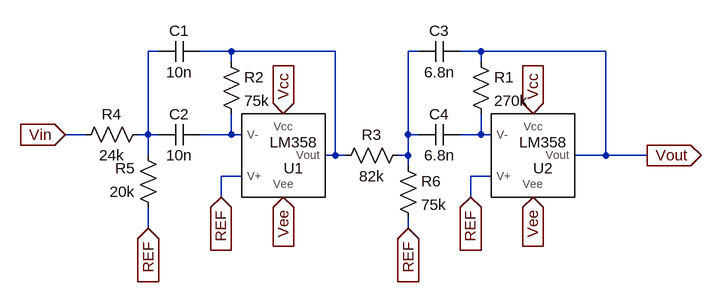
[diagram p0: schematic filter_stage.asc]
filter_stage.asc, the LTspice schematic file:
Version 4
SHEET 1 880 680
WIRE -16 16 -32 16
WIRE 96 16 48 16
WIRE 256 16 96 16
WIRE 384 16 368 16
WIRE 480 16 448 16
WIRE 672 16 480 16
WIRE 96 32 96 16
WIRE 480 32 480 16
WIRE -128 144 -160 144
WIRE -32 144 -32 16
WIRE -32 144 -48 144
WIRE -16 144 -32 144
WIRE 96 144 96 112
WIRE 96 144 48 144
WIRE 112 144 96 144
WIRE 368 144 368 16
WIRE 384 144 368 144
WIRE 480 144 480 112
WIRE 480 144 448 144
WIRE 496 144 480 144
WIRE -32 176 -32 144
WIRE 256 176 256 16
WIRE 256 176 240 176
WIRE 272 176 256 176
WIRE 368 176 368 144
WIRE 368 176 352 176
WIRE 672 176 672 16
WIRE 672 176 624 176
WIRE 736 176 672 176
WIRE 368 192 368 176
WIRE 112 208 80 208
WIRE 496 208 464 208
WIRE 80 240 80 208
WIRE 464 240 464 208
WIRE -32 288 -32 256
WIRE 368 288 368 272
FLAG -32 288 REF
IOPIN -32 288 In
FLAG -160 144 Vin
IOPIN -160 144 In
FLAG 736 176 Vout
IOPIN 736 176 Out
FLAG 560 112 Vcc
IOPIN 560 112 In
FLAG 176 112 Vcc
IOPIN 176 112 In
FLAG 560 240 Vee
IOPIN 560 240 In
FLAG 80 240 REF
IOPIN 80 240 In
FLAG 368 288 REF
IOPIN 368 288 In
FLAG 464 240 REF
IOPIN 464 240 In
FLAG 176 240 Vee
IOPIN 176 240 In
SYMBOL LM358 192 176 R0
SYMATTR InstName U1
SYMBOL LM358 576 176 R0
SYMATTR InstName U2
SYMBOL cap 48 128 R90
WINDOW 0 0 32 VBottom 2
WINDOW 3 32 32 VTop 2
SYMATTR InstName C2
SYMATTR Value 10n
SYMBOL cap 448 0 R90
WINDOW 0 0 32 VBottom 2
WINDOW 3 32 32 VTop 2
SYMATTR InstName C3
SYMATTR Value 6.8n
SYMBOL cap 448 128 R90
WINDOW 0 0 32 VBottom 2
WINDOW 3 32 32 VTop 2
SYMATTR InstName C4
SYMATTR Value 6.8n
SYMBOL res 464 16 R0
SYMATTR InstName R1
SYMATTR Value 270k
SYMBOL cap -16 0 M90
WINDOW 0 0 32 VBottom 2
WINDOW 3 32 32 VTop 2
SYMATTR InstName C1
SYMATTR Value 10n
SYMBOL res 80 16 R0
SYMATTR InstName R2
SYMATTR Value 75k
SYMBOL res 368 160 R90
WINDOW 0 0 56 VBottom 2
WINDOW 3 32 56 VTop 2
SYMATTR InstName R3
SYMATTR Value 82k
SYMBOL res -32 128 R90
WINDOW 0 0 56 VBottom 2
WINDOW 3 32 56 VTop 2
SYMATTR InstName R4
SYMATTR Value 24k
SYMBOL res -16 272 R180
WINDOW 0 36 76 Left 2
WINDOW 3 36 40 Left 2
SYMATTR InstName R5
SYMATTR Value 20k
SYMBOL res 352 176 R0
SYMATTR InstName R6
SYMATTR Value 75k

The netlist it stands for:
* filter_stage.asc
XU1 N004 REF N002 Vcc Vee LM358  ; pins V- V+ Vout Vcc Vee
XU2 N005 REF Vout Vcc Vee LM358  ; pins V- V+ Vout Vcc Vee
C2 N004 N001 10n
C3 Vout N003 6.8n
C4 N005 N003 6.8n
R1 Vout N005 270k
C1 N001 N002 10n
R2 N002 N004 75k
R3 N003 N002 82k
R4 N001 Vin 24k
R5 REF N001 20k
R6 N003 REF 75k
.lib C:\Users\leoar\Documents\EE2\Project\Radar\SPICEMODELS\en.lm358\lm358.txt
.backanno
.end